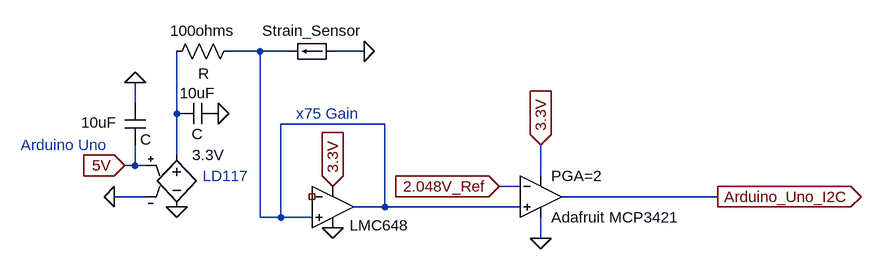
[diagram p0: schematic autobender circuit.asc]
autobender circuit.asc, the LTspice schematic file:
Version 4.1
SHEET 1 1292 680
WIRE 320 0 272 0
WIRE 368 0 320 0
WIRE 480 0 432 0
WIRE 128 80 128 48
WIRE 192 96 192 0
WIRE 512 112 352 112
WIRE 192 160 192 96
WIRE 128 176 128 144
WIRE 128 176 112 176
WIRE 144 176 128 176
WIRE 752 192 752 144
WIRE 720 208 688 208
WIRE 144 224 96 224
WIRE 1024 224 784 224
WIRE 512 240 512 112
WIRE 512 240 464 240
WIRE 720 240 512 240
WIRE 320 256 320 0
WIRE 352 256 352 112
WIRE 352 256 320 256
WIRE 400 256 352 256
WIRE 752 288 752 256
FLAG 112 176 5V
IOPIN 112 176 In
FLAG 96 224 0
FLAG 192 240 0
FLAG 480 0 0
FLAG 432 208 3.3V
IOPIN 432 208 In
FLAG 432 272 0
FLAG 688 208 2.048V_Ref
IOPIN 688 208 In
FLAG 752 144 3.3V
IOPIN 752 144 In
FLAG 752 288 0
FLAG 1024 224 Arduino_Uno_I2C
IOPIN 1024 224 Out
FLAG 128 48 0
FLAG 256 96 0
SYMBOL e 192 144 R0
SYMATTR InstName 3.3V
SYMATTR Value ""
SYMBOL res 288 -16 R90
WINDOW 0 0 56 VBottom 2
WINDOW 3 35 54 VTop 2
SYMATTR InstName 100ohms
SYMBOL load 432 -16 R90
WINDOW 0 0 32 VBottom 2
WINDOW 3 40 32 VTop 2
SYMATTR InstName Strain_Sensor
SYMATTR Value ""
SYMBOL OpAmps\\opamp2 432 176 R0
WINDOW 0 26 92 Left 2
SYMATTR InstName LMC648
SYMATTR Value ""
SYMBOL OpAmps\\opamp2 752 160 R0
SYMATTR InstName PGA=2
SYMATTR Value Adafruit MCP3421
SYMBOL cap 112 80 R0
WINDOW 0 -67 30 Left 2
SYMATTR InstName 10uF
SYMBOL cap 256 80 R90
WINDOW 0 0 32 VBottom 2
WINDOW 3 32 32 VTop 2
SYMATTR InstName 10uF
TEXT -48 144 Left 2 ;Arduino Uno
TEXT 232 192 Left 2 ;LD117
TEXT 376 96 Left 2 ;x75 Gain

The netlist it stands for:
* autobender circuit.asc
E§3.3V N002 0 5V 0
R§100ohms N001 N002 R
I§Strain_Sensor 0 N001
X§LMC648 N001 NC_01 3.3V 0 N001 opamp2  ; pins In+ In- V+ V- OUT
X§PGA=2 N001 2.048V_Ref 3.3V 0 Arduino_Uno_I2C Adafruit MCP3421  ; pins In+ In- V+ V- OUT
C§10uF 0 5V C
C§10uF 0 N002 C
* Arduino Uno
* LD117
* x75 Gain
.backanno
.end